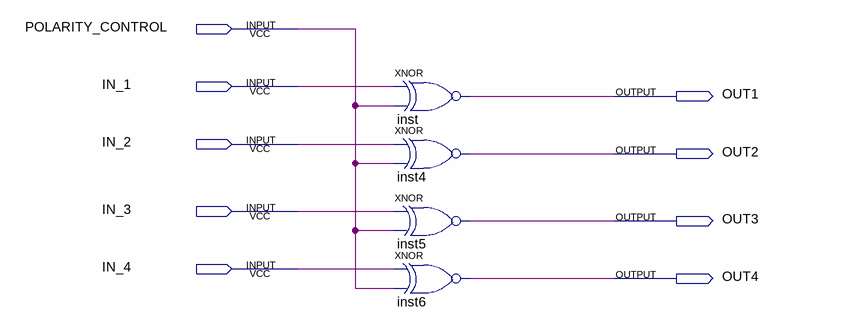
[diagram p0: schematic sheet]
// Quartus schematic schem_gates_activeLow.bdf as structural Verilog: 4 symbols, 9 pins
module schem_gates_activeLow (
  input  POLARITY_CONTROL,
  input  IN_1,
  input  IN_2,
  input  IN_3,
  input  IN_4,
  output OUT1,
  output OUT2,
  output OUT3,
  output OUT4
);

  xnor inst (OUT1, IN_1, POLARITY_CONTROL);
  xnor inst4 (OUT2, IN_2, POLARITY_CONTROL);
  xnor inst5 (OUT3, IN_3, POLARITY_CONTROL);
  xnor inst6 (OUT4, IN_4, POLARITY_CONTROL);
endmodule
